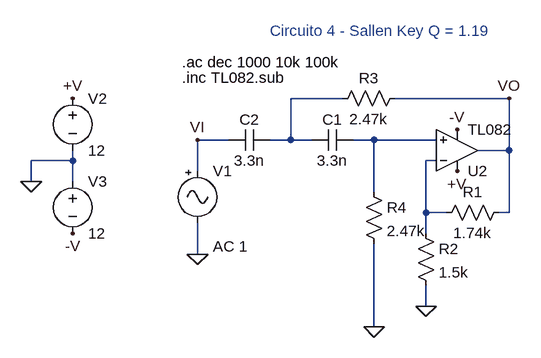
[diagram p0: schematic Circuito4.asc]
Circuito4.asc, the LTspice schematic file:
Version 4
SHEET 1 880 680
WIRE -64 96 -144 96
WIRE 192 96 16 96
WIRE -240 160 -288 160
WIRE -144 160 -144 96
WIRE -144 160 -176 160
WIRE -112 160 -144 160
WIRE -16 160 -48 160
WIRE 80 160 -16 160
WIRE 192 176 192 96
WIRE 192 176 144 176
WIRE -480 192 -480 176
WIRE -480 192 -544 192
WIRE 80 192 64 192
WIRE -288 208 -288 160
WIRE -544 224 -544 192
WIRE -480 224 -480 192
WIRE -16 240 -16 160
WIRE 64 272 64 192
WIRE 96 272 64 272
WIRE 192 272 192 176
WIRE 192 272 176 272
WIRE 64 304 64 272
WIRE -288 336 -288 288
WIRE 64 416 64 384
WIRE -16 448 -16 320
FLAG 64 416 0
FLAG 192 96 VO
FLAG -288 336 0
FLAG -16 448 0
FLAG -288 160 VI
FLAG -544 224 0
FLAG -480 96 +V
FLAG -480 304 -V
FLAG 112 208 +V
FLAG 112 144 -V
SYMBOL cap -48 144 R90
WINDOW 0 0 32 VBottom 2
WINDOW 3 32 32 VTop 2
SYMATTR InstName C1
SYMATTR Value 3.3n
SYMBOL cap -176 144 R90
WINDOW 0 0 32 VBottom 2
WINDOW 3 32 32 VTop 2
SYMATTR InstName C2
SYMATTR Value 3.3n
SYMBOL res 192 256 R90
WINDOW 0 0 56 VBottom 2
WINDOW 3 32 56 VTop 2
SYMATTR InstName R1
SYMATTR Value 1.74k
SYMBOL res 48 288 R0
SYMATTR InstName R2
SYMATTR Value 1.5k
SYMBOL res 32 80 R90
WINDOW 0 0 56 VBottom 2
WINDOW 3 32 56 VTop 2
SYMATTR InstName R3
SYMATTR Value 2.47k
SYMBOL res -32 224 R0
SYMATTR InstName R4
SYMATTR Value 2.47k
SYMBOL Misc\\signal -288 192 R0
WINDOW 123 24 132 Left 2
WINDOW 39 0 0 Left 2
SYMATTR Value2 AC 1
SYMATTR InstName V1
SYMATTR Value ""
SYMBOL Opamps\\opamp2 112 240 M180
SYMATTR InstName U2
SYMATTR Value TL082
SYMBOL voltage -480 80 R0
WINDOW 123 0 0 Left 2
WINDOW 39 0 0 Left 2
SYMATTR InstName V2
SYMATTR Value 12
SYMBOL voltage -480 208 R0
WINDOW 123 0 0 Left 2
WINDOW 39 0 0 Left 2
SYMATTR InstName V3
SYMATTR Value 12
TEXT -312 64 Left 2 !.inc TL082.sub
TEXT -312 40 Left 2 !.ac dec 1000 10k 100k
TEXT -176 -8 Left 2 ;Circuito 4 - Sallen Key Q = 1.19

The netlist it stands for:
* Circuito4.asc
C1 N002 N001 3.3n
C2 N001 VI 3.3n
R1 VO N003 1.74k
R2 N003 0 1.5k
R3 VO N001 2.47k
R4 N002 0 2.47k
V1 VI 0 AC 1
XU2 N002 N003 +V -V VO TL082  ; pins In+ In- V+ V- OUT
V2 +V 0 12
V3 0 -V 12
.inc TL082.sub
.ac dec 1000 10k 100k
* Circuito 4 - Sallen Key Q = 1.19
.backanno
.end